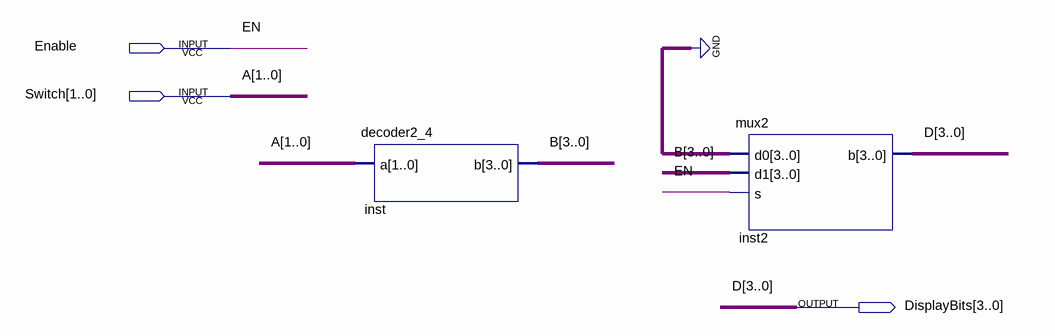
[diagram p0: schematic sheet]
// Quartus schematic DisplayBlock.bdf as structural Verilog: 2 symbols, 3 pins
module DisplayBlock (
  input  Enable,
  input  [1:0] Switch,
  output [3:0] DisplayBits
);

  wire [3:0] B;

  decoder2_4 inst (.a(Switch), .b(B));
  mux2 inst2 (.d0(4'b0000), .d1(B), .s(Enable), .b(DisplayBits));

  // Other names for the same wires on the sheet: A[1:0] = Switch; D[3:0] = DisplayBits; EN = Enable
endmodule
